# Altium schematic sheet Block Diagram.SchDoc
size A4
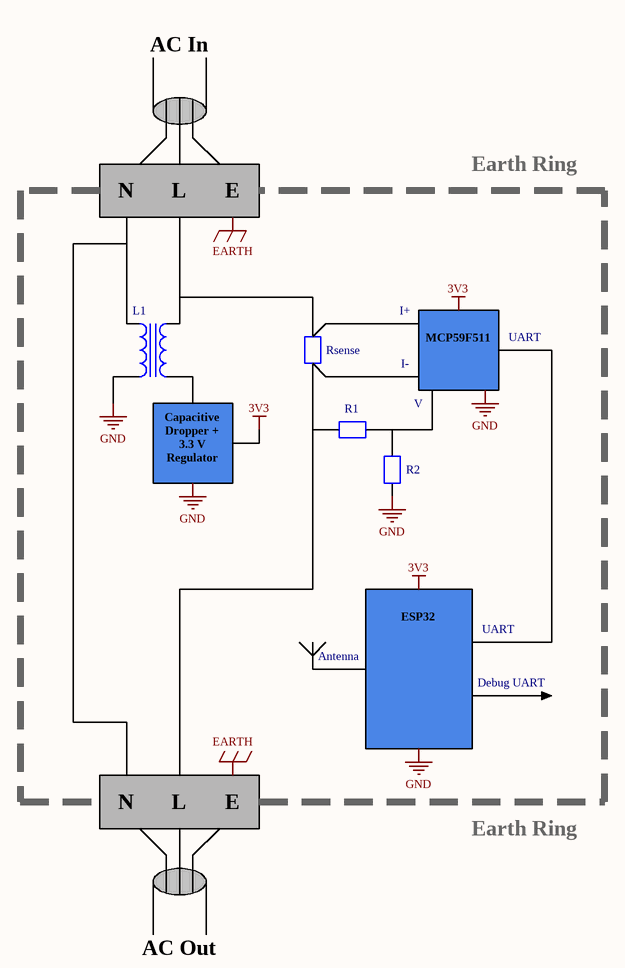
[diagram p0: Block Diagram.SchDoc]

## Parts
R1  Resistor  [0805]  (value not drawn)
R2  Resistor  [0805]  (value not drawn)
Rsense  Resistor  [0805]  (value not drawn)

## Nets
GND: R2.1

Not connected (* = marked no-connect by the designer): R1 1 2; R2 2; Rsense 1 2

## Notes on the sheet
- AC In
- Earth Ring
- N
- L
- E
- L1
- I+
- I-
- UART
- MCP59F511
- V
- Capacitive Dropper + 3.3 V Regulator
- Antenna
- Debug UART
- ESP32
- AC Out
- Labels drawn without touching a wire or pin: 3V3, EARTH, GND

## Library data of the parts
R1 R2 Rsense = Resistor: Unique Part Number: LM_RES_0001; Manufacturer Part Number: Stackpole Electronics Inc RMCF0805FT1K00; Resistance: 1 kR; Type (Chip, Axial, etc#): Chip; Power: 0.125 W; Tolerance: 0.01; Digikey Part Number: RMCF0805FT1K00CT-ND; Package: 0805 (2012 Metric)